# Altium schematic sheet 232串口.SchDoc
size A4
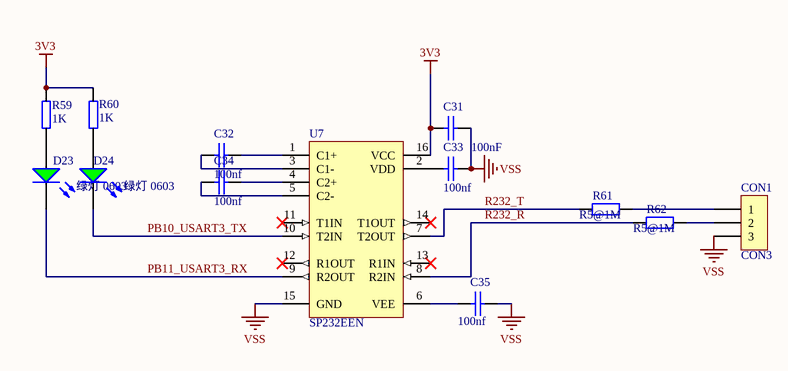
[diagram p0: 232串口.SchDoc]

## Parts
C31  100nF  [LC-0603_C]
C32  100nf  [LC-0603_C]
C33  100nf  [LC-0603_C]
C34  100nf  [LC-0603_C]
C35  100nf  [LC-0603_C]
CON1  CON3  [VH3.96-W-3P]
D23  绿灯 0603  [LC-0603_LED_S1]
D24  绿灯 0603  [LC-0603_LED_S1]
R59  1K  [LC-0603_R]
R60  1K  [LC-0603_R]
R61  R5@1M  [0603-1]
R62  R5@1M  [0603-1]
U7  SP232EEN  [SOIC-16]

## Nets
3V3: C31.2 R59.2 R60.1 U7.16(VCC)
VSS: C31.1 C33.2 C35.2 CON1.3 U7.15(GND)
PB10_USART3_TX: D24.K U7.10(T2IN)
PB11_USART3_RX: D23.K U7.9(R2OUT)
R232_R: R62.2 U7.8(R2IN)
R232_T: R61.2 U7.7(T2OUT)
NetC32_1: C32.1 U7.3(C1-)
NetC32_2: C32.2 U7.1(C1+)
NetC33_1: C33.1 U7.2(VDD)
NetC34_1: C34.1 U7.5(C2-)
NetC34_2: C34.2 U7.4(C2+)
NetC35_1: C35.1 U7.6(VEE)
NetCON1_1: CON1.1 R61.1
NetCON1_2: CON1.2 R62.1
NetD23_A: D23.A R59.1
NetD24_A: D24.A R60.2

Not connected (* = marked no-connect by the designer): U7 11(T1IN)* 12(R1OUT)* 13(R1IN)* 14(T1OUT)*

## Library data of the parts
C31-C35 = CAP: Capacitor
CON1 = CON3: Connector
D23 D24 = 0603 绿灯: 发光二极管; ComponentLink1Description: 供应商链接; ComponentLink1URL: http://www.szlcsc.com/product/details_73152.html; Package: 0603; Supplier: LC; SuppliersPartNumber: C72043
R59 R60 = RES2
R61 R62 = Res2: Resistor; Value: 10K; Published: 8-Jun-2000; LatestRevisionDate: 17-Jul-2002; LatestRevisionNote: Re-released for DXP Platform.; PackageReference: AXIAL-0.4; Publisher: Altium Limited
U7 = MAX232: +5V Powered, Multi-Channel RS-232 Driver/Receiver; Published: 16-Jan-2001; LatestRevisionDate: 13-Apr-2006; LatestRevisionNote: IPC-7351 Footprint Added.; PackageReference: NSO16; Publisher: Altium Limited; PackageDescription: 16-Pin Small Outline Integrated Circuit 1.27 mm Pitch; Code_JEDEC: MS-012-AC; Code_IPC: SOIC127P600-16; ComponentLink1Description: Manufacturer Link; ComponentLink1URL: http://www.maxim-ic.com/; ComponentLink2Description: Datasheet; ComponentLink2URL: http://pdfserv.maxim-ic.com/en/ds/MAX220-MAX249.pdf